# Altium project base-32-bit.PrjPcb
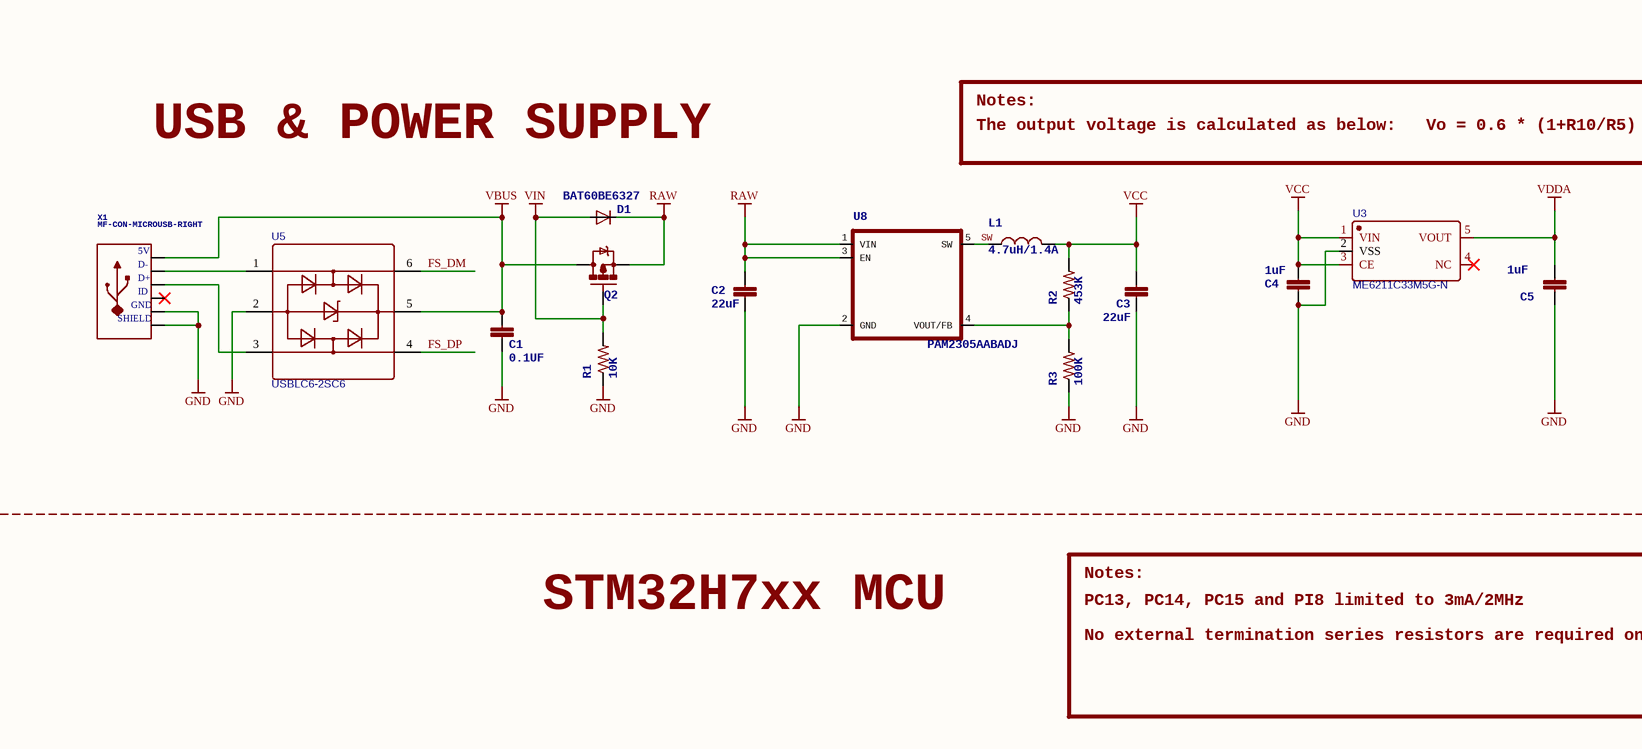
[diagram p0: base-32-bit.SchDoc, top left]
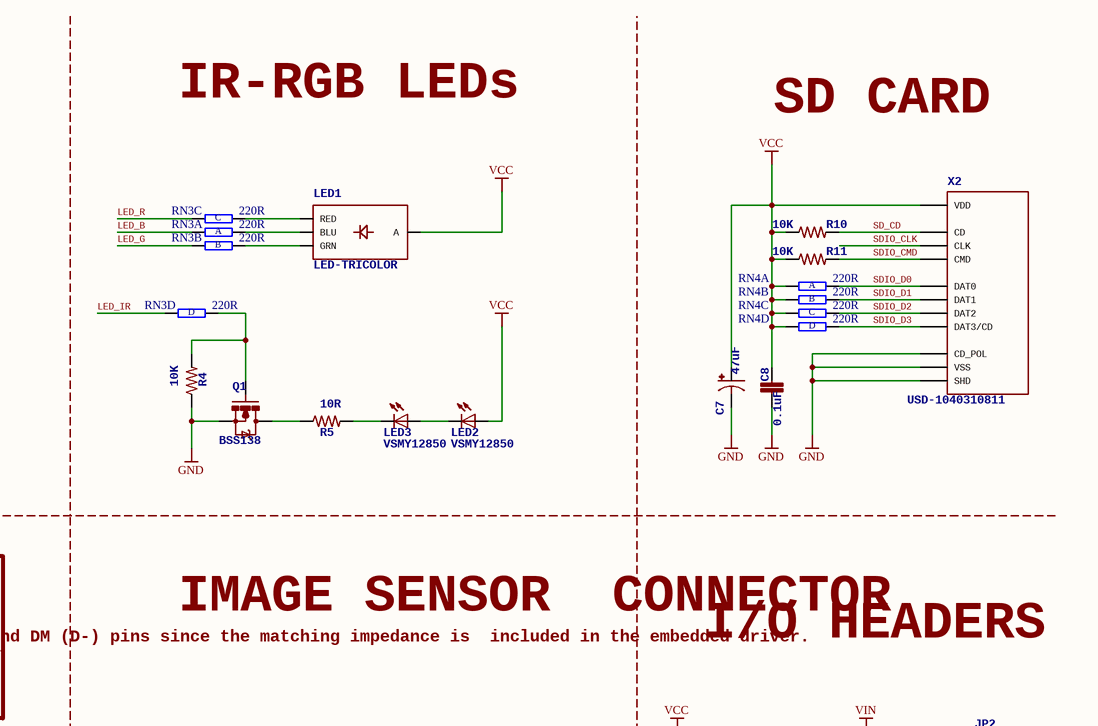
[diagram p1: base-32-bit.SchDoc, top right]
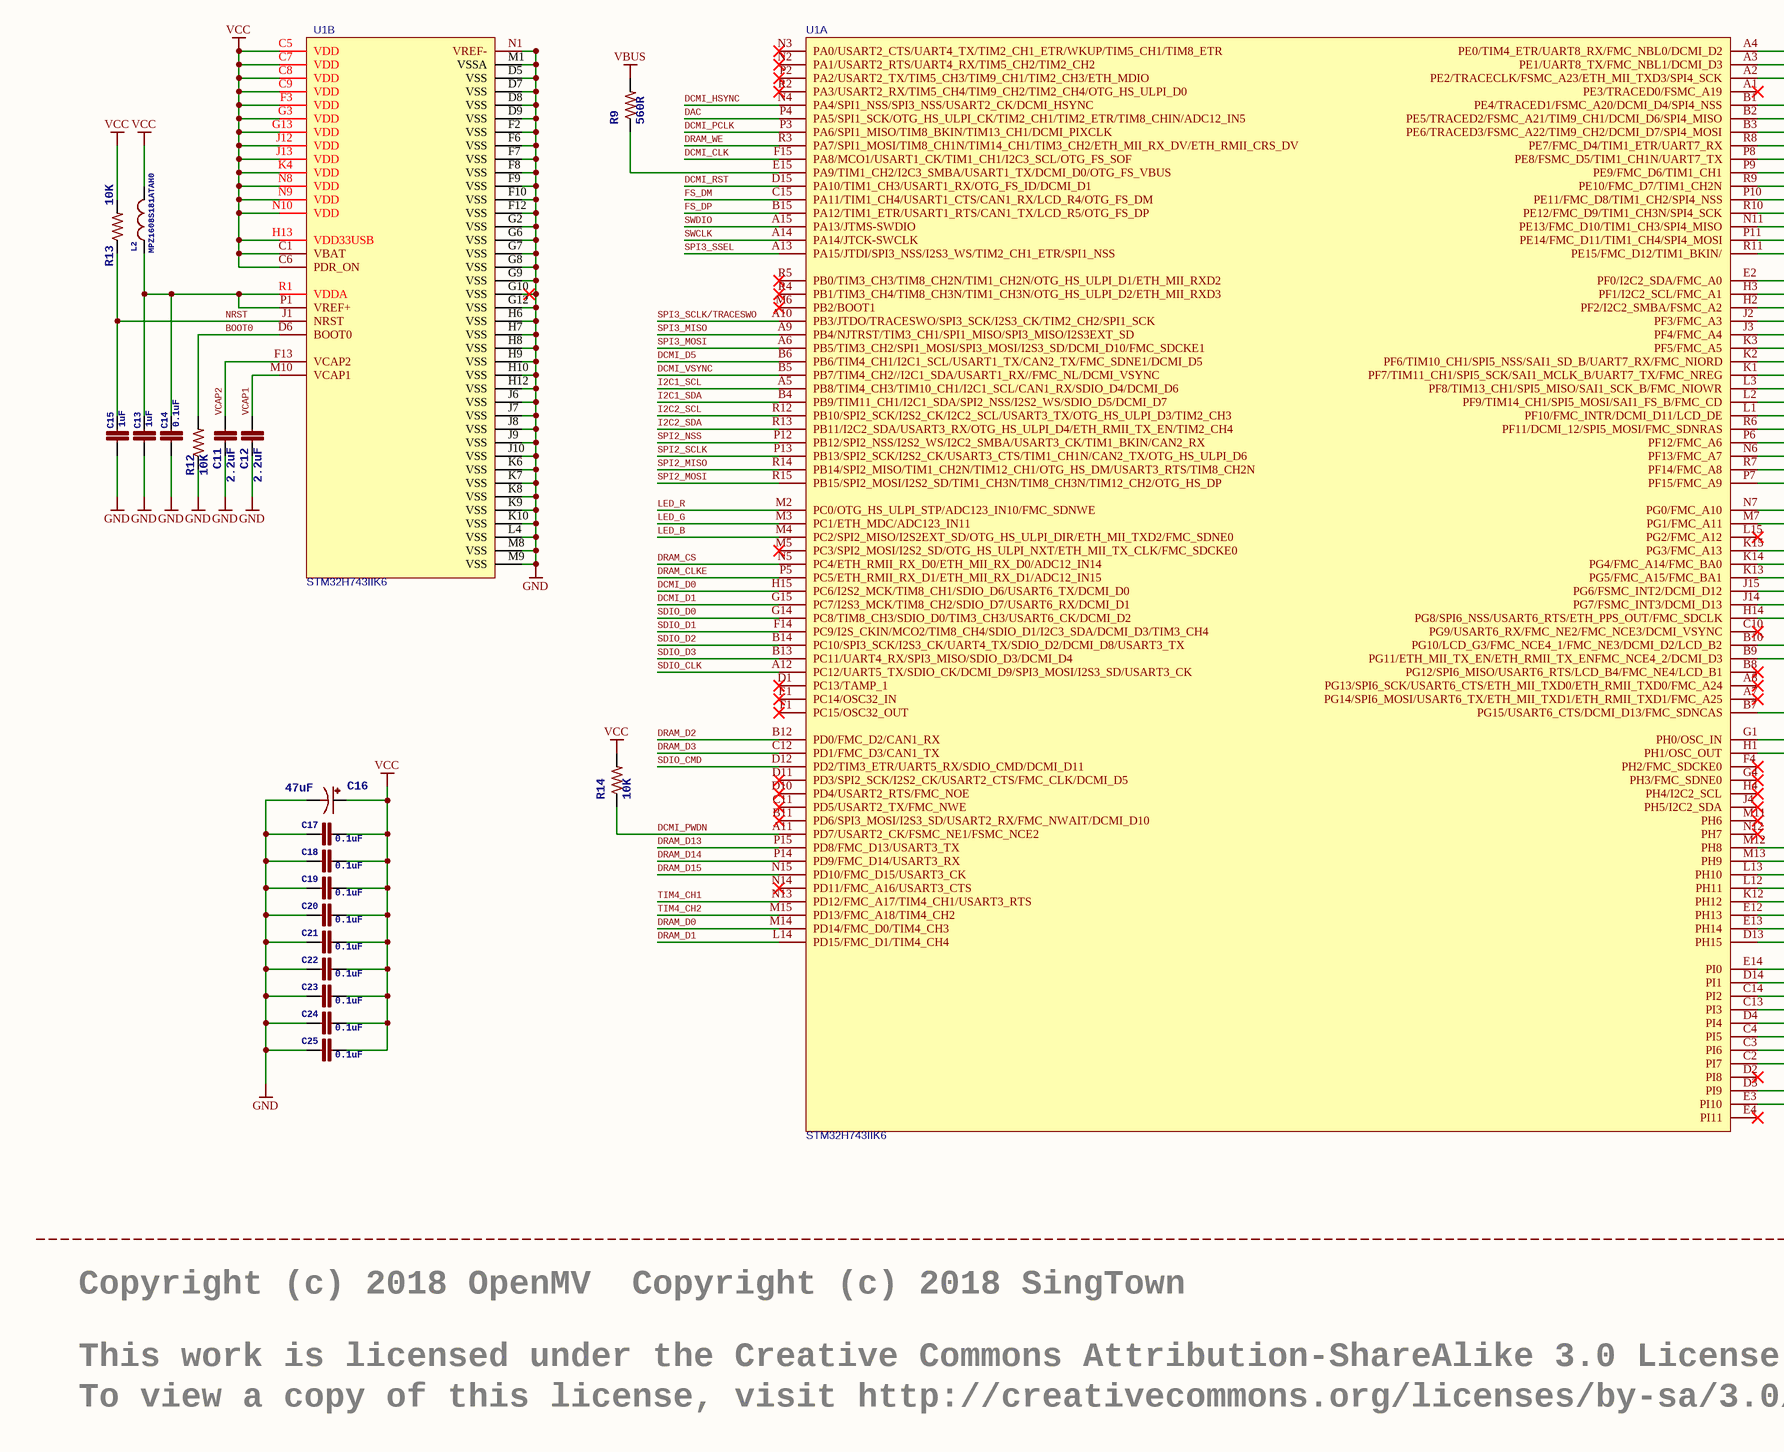
[diagram p2: base-32-bit.SchDoc, bottom left]
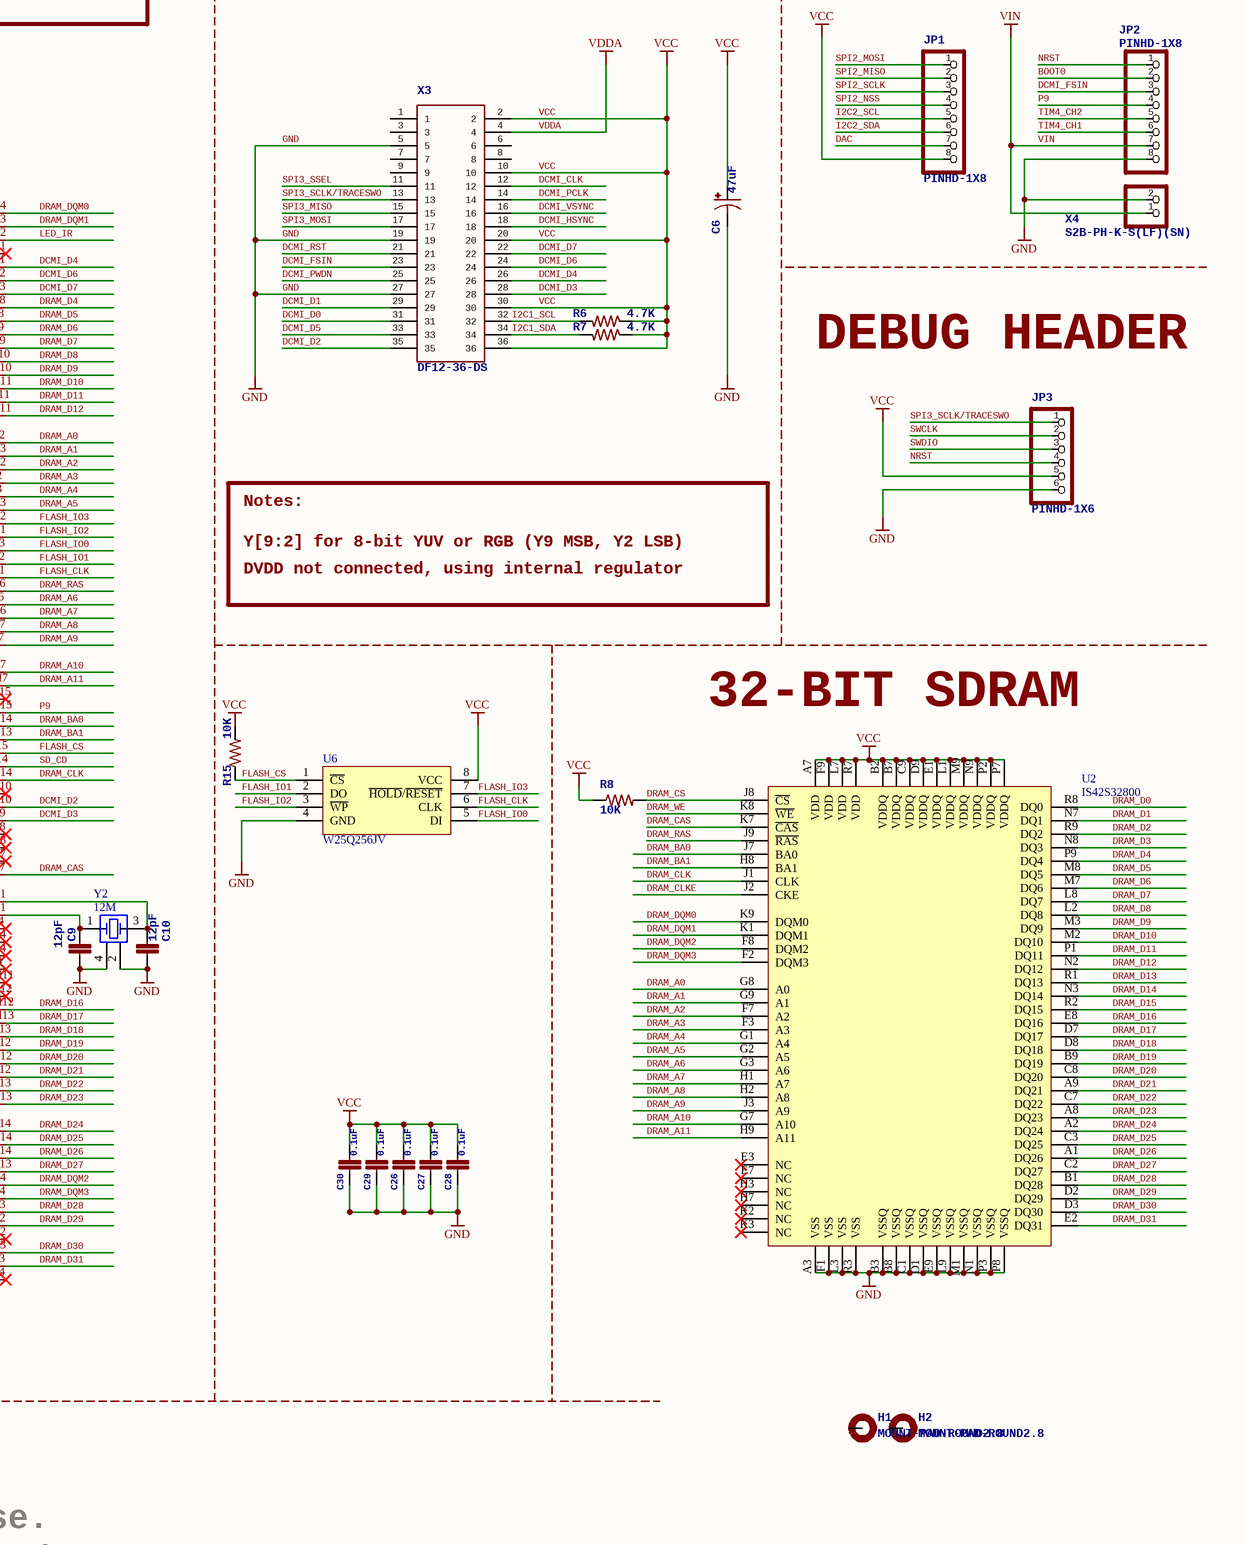
[diagram p3: base-32-bit.SchDoc, bottom right]
1 sheet, 71 parts. Net scope: global (net labels, ports and power ports of the same name join across sheets).
Board file: base-32-bit.PcbDoc

## Sheet base-32-bit.SchDoc
size 580 x 453 mm

### Parts
C1  0.1UF  [C0603]
C2  22uF  [0805]
C3  22uF  [0805]
C4  1uF  [0805]
C5  1uF  [0805]
C6  47uF  [EIA3216]
C7  47uF  [EIA3216]
C8  0.1uF  [0603-CAP]
C9  12pF  [0603-CAP]
C10  12pF  [0603-CAP]
C11  2.2uF  [C0402]
C12  2.2uF  [C0402]
C13  1uF  [C0402]
C14  0.1uF  [C0402]
C15  1uF  [C0402]
C16  47uF  [EIA3216]
C17  0.1uF  [C0402]
C18  0.1uF  [C0402]
C19  0.1uF  [C0402]
C20  0.1uF  [C0402]
C21  0.1uF  [C0402]
C22  0.1uF  [C0402]
C23  0.1uF  [C0402]
C24  0.1uF  [C0402]
C25  0.1uF  [C0402]
C26  0.1uF  [C0402]
C27  0.1uF  [C0402]
C28  0.1uF  [C0402]
C29  0.1uF  [C0402]
C30  0.1uF  [C0402]
D1  BAT60BE6327  [SOD-323]
H1  MOUNT-PAD-ROUND2.8  [2,8-PAD]
H2  MOUNT-PAD-ROUND2.8  [2,8-PAD]
JP1  PINHD-1X8  [1X08]
JP2  PINHD-1X8  [1X08]
JP3  PINHD-1X6  [1X06]
L1  4.7uH/1.4A  [1007]
L2  MPZ1608S181ATAH0  [0603]
LED1  LED-TRICOLOR  [LED-TRICOLOR-SMD]
LED2  VSMY12850  [LED-1206]
LED3  VSMY12850  [LED-1206]
Q1  BSS138  [SOT23-3]
Q2  Si2301BDS  [SOT23-3]  (value not drawn)
R1  10K  [R0603]
R2  453K  [R0603]
R3  100K  [R0603]
R4  10K  [R0603]
R5  10R  [R0603]
R6  4.7K  [R0603]
R7  4.7K  [R0603]
R8  10K  [R0402]
R9  560R  [R0603]
R10  10K  [R0603]
R11  10K  [R0603]
R12  10K  [R0603]
R13  10K  [R0402]
R14  10K  [R0603]
R15  10K  [R0603]
RN3  220R  [RCA-8P4R-0402]  (parts A,B,C,D of 4)
RN4  220R  [RCA-8P4R-0402]  (parts A,B,C,D of 4)
U1  STM32H743IIK6  [UFBGA-201_L10.0-W10.0-P0.65-TL_STM32H743IIK6]  (parts A,B of 2)
U2  IS42S32800  [BGA-90-8000X13000DE]
U3  ME6211C33M5G-N  [SOT-23-5]
U5  USBLC6-2SC6  [SOT-23-6]
U6  W25Q256JV  [WSON-8_L8.0-W6.10-P1.27-BL-EP]
U8  PAM2305AABADJ  [TSOT25]
X1  MF-CON-MICROUSB-RIGHT  [MICROUSB-RIGHT]
X2  USD-1040310811  [1040310811]
X3  DF12-36-DS  [DF12-36-DS]
X4  S2B-PH-K-S(LF)(SN)  [JST-PH-2-THM-RA]
Y2  12M  [OSC-SMD_4P-L2.5-W2.0-BL]

### Nets
GND: C1.1 C2.1 C3.1 C4.1 C5.1 C6.C(-) C7.C(-) C8.2 C9.1 C10.1 C11.2 C12.2 C13.2 C14.2 C15.2 C16.C(-) C17.2 C18.2 C19.2 C20.2 C21.2 C22.2 C23.2 C24.2 C25.2 C26.2 C27.2 C28.2 C29.2 C30.2 JP2.8 JP3.6 Q1.2(S) R1.1 R3.1 R4.1 R12.1 U1.D5(VSS) U1.D7(VSS) U1.D8(VSS) U1.D9(VSS) U1.F2(VSS) U1.F6(VSS) U1.F7(VSS) U1.F8(VSS) U1.F9(VSS) U1.F10(VSS) U1.F12(VSS) U1.G2(VSS) U1.G6(VSS) U1.G7(VSS) U1.G8(VSS) U1.G9(VSS) U1.G10(VSS) U1.G12(VSS) U1.H6(VSS) U1.H7(VSS) U1.H8(VSS) U1.H9(VSS) U1.H10(VSS) U1.H12(VSS) U1.J6(VSS) U1.J7(VSS) U1.J8(VSS) U1.J9(VSS) U1.J10(VSS) U1.K6(VSS) U1.K7(VSS) U1.K8(VSS) U1.K9(VSS) U1.K10(VSS) U1.L4(VSS) U1.M1(VSSA) U1.M8(VSS) U1.M9(VSS) U1.N1(VREF-) U2.A3(VSS) U2.B3(VSSQ) U2.B8(VSSQ) U2.C1(VSSQ) U2.D1(VSSQ) U2.E9(VSSQ) U2.F1(VSS) U2.L3(VSS) U2.L9(VSSQ) U2.M1(VSSQ) U2.N1(VSSQ) U2.P3(VSSQ) U2.P8(VSSQ) U2.R3(VSS) U3.2(VSS) U5.2 U6.4(GND) U8.2(GND) X1.5(GND) X1.S(SLD) X2.CD$2(CD_POL) X2.G(SHD) X2.P$6(VSS) X3.5 X3.19 X3.27 X4.2 Y2.2(OSC2) Y2.4(OSC4)
RAW: C2.2 D1.1(C) Q2.2(S) U8.1(VIN) U8.3(EN)
VBUS: C1.2 Q2.3(D) R9.2 U5.5 X1.1(5V)
VCC: C3.2 C4.2 C6.A(+) C7.A(+) C8.1 C16.A(+) C17.1 C18.1 C19.1 C20.1 C21.1 C22.1 C23.1 C24.1 C25.1 C26.1 C27.1 C28.1 C29.1 C30.1 JP1.8 JP3.5 L1.2 L2.2 LED1.A LED2.A R2.2 R6.1 R7.1 R8.1 R10.1 R11.1 R13.2 R14.2 R15.2 RN4.1 RN4.2 RN4.3 RN4.4 U1.C1(VBAT) U1.C5(VDD) U1.C6(PDR_ON) U1.C7(VDD) U1.C8(VDD) U1.C9(VDD) U1.F3(VDD) U1.G3(VDD) U1.G13(VDD) U1.H13(VDD33USB) U1.J12(VDD) U1.J13(VDD) U1.K4(VDD) U1.N8(VDD) U1.N9(VDD) U1.N10(VDD) U2.A7(VDD) U2.B2(VDDQ) U2.B7(VDDQ) U2.C9(VDDQ) U2.D9(VDDQ) U2.E1(VDDQ) U2.F9(VDD) U2.L1(VDDQ) U2.L7(VDD) U2.M9(VDDQ) U2.N9(VDDQ) U2.P2(VDDQ) U2.P7(VDDQ) U2.R7(VDD) U3.1(VIN) U3.3(CE) U6.8(VCC) X2.P$4(VDD) X3.2 X3.10 X3.20 X3.30 X3.36
VDDA: C5.2 U3.5(VOUT) X3.4
VIN: D1.2(A) JP2.7 Q2.1(G) R1.2 X4.1
BOOT0: JP2.2 R12.2 U1.D6(BOOT0)
DAC: JP1.7 U1.P4(PA5/SPI1_SCK/OTG_HS_ULPI_CK/TIM2_CH1/TIM2_ETR/TIM8_CHIN/ADC12_IN5)
DCMI_CLK: U1.F15(PA8/MCO1/USART1_CK/TIM1_CH1/I2C3_SCL/OTG_FS_SOF) X3.12
DCMI_D0: U1.H15(PC6/I2S2_MCK/TIM8_CH1/SDIO_D6/USART6_TX/DCMI_D0) X3.31
DCMI_D1: U1.G15(PC7/I2S3_MCK/TIM8_CH2/SDIO_D7/USART6_RX/DCMI_D1) X3.29
DCMI_D2: U1.B10(PG10/LCD_G3/FMC_NCE4_1/FMC_NE3/DCMI_D2/LCD_B2) X3.35
DCMI_D3: U1.B9(PG11/ETH_MII_TX_EN/ETH_RMII_TX_ENFMC_NCE4_2/DCMI_D3) X3.28
DCMI_D4: U1.B1(PE4/TRACED1/FSMC_A20/DCMI_D4/SPI4_NSS) X3.26
DCMI_D5: U1.B6(PB6/TIM4_CH1/I2C1_SCL/USART1_TX/CAN2_TX/FMC_SDNE1/DCMI_D5) X3.33
DCMI_D6: U1.B2(PE5/TRACED2/FSMC_A21/TIM9_CH1/DCMI_D6/SPI4_MISO) X3.24
DCMI_D7: U1.B3(PE6/TRACED3/FSMC_A22/TIM9_CH2/DCMI_D7/SPI4_MOSI) X3.22
DCMI_FSIN: JP2.3 X3.23
DCMI_HSYNC: U1.N4(PA4/SPI1_NSS/SPI3_NSS/USART2_CK/DCMI_HSYNC) X3.18
DCMI_PCLK: U1.P3(PA6/SPI1_MISO/TIM8_BKIN/TIM13_CH1/DCMI_PIXCLK) X3.14
DCMI_PWDN: R14.1 U1.A11(PD7/USART2_CK/FSMC_NE1/FSMC_NCE2) X3.25
DCMI_RST: U1.D15(PA10/TIM1_CH3/USART1_RX/OTG_FS_ID/DCMI_D1) X3.21
DCMI_VSYNC: U1.B5(PB7/TIM4_CH2//I2C1_SDA/USART1_RX//FMC_NL/DCMI_VSYNC) X3.16
DRAM_A0: U1.E2(PF0/I2C2_SDA/FMC_A0) U2.G8(A0)
DRAM_A1: U1.H3(PF1/I2C2_SCL/FMC_A1) U2.G9(A1)
DRAM_A2: U1.H2(PF2/I2C2_SMBA/FSMC_A2) U2.F7(A2)
DRAM_A3: U1.J2(PF3/FMC_A3) U2.F3(A3)
DRAM_A4: U1.J3(PF4/FMC_A4) U2.G1(A4)
DRAM_A5: U1.K3(PF5/FMC_A5) U2.G2(A5)
DRAM_A6: U1.P6(PF12/FMC_A6) U2.G3(A6)
DRAM_A7: U1.N6(PF13/FMC_A7) U2.H1(A7)
DRAM_A8: U1.R7(PF14/FMC_A8) U2.H2(A8)
DRAM_A9: U1.P7(PF15/FMC_A9) U2.J3(A9)
DRAM_A10: U1.N7(PG0/FMC_A10) U2.G7(A10)
DRAM_A11: U1.M7(PG1/FMC_A11) U2.H9(A11)
DRAM_BA0: U1.K14(PG4/FMC_A14/FMC_BA0) U2.J7(BA0)
DRAM_BA1: U1.K13(PG5/FMC_A15/FMC_BA1) U2.H8(BA1)
DRAM_CAS: U1.B7(PG15/USART6_CTS/DCMI_D13/FMC_SDNCAS) U2.K7(~{CAS})
DRAM_CLK: U1.H14(PG8/SPI6_NSS/USART6_RTS/ETH_PPS_OUT/FMC_SDCLK) U2.J1(CLK)
DRAM_CLKE: U1.P5(PC5/ETH_RMII_RX_D1/ETH_MII_RX_D1/ADC12_IN15) U2.J2(CKE)
DRAM_CS: R8.2 U1.N5(PC4/ETH_RMII_RX_D0/ETH_MII_RX_D0/ADC12_IN14) U2.J8(~{CS})
DRAM_D0: U1.M14(PD14/FMC_D0/TIM4_CH3) U2.R8(DQ0)
DRAM_D1: U1.L14(PD15/FMC_D1/TIM4_CH4) U2.N7(DQ1)
DRAM_D2: U1.B12(PD0/FMC_D2/CAN1_RX) U2.R9(DQ2)
DRAM_D3: U1.C12(PD1/FMC_D3/CAN1_TX) U2.N8(DQ3)
DRAM_D4: U1.R8(PE7/FMC_D4/TIM1_ETR/UART7_RX) U2.P9(DQ4)
DRAM_D5: U1.P8(PE8/FSMC_D5/TIM1_CH1N/UART7_TX) U2.M8(DQ5)
DRAM_D6: U1.P9(PE9/FMC_D6/TIM1_CH1) U2.M7(DQ6)
DRAM_D7: U1.R9(PE10/FMC_D7/TIM1_CH2N) U2.L8(DQ7)
DRAM_D8: U1.P10(PE11/FMC_D8/TIM1_CH2/SPI4_NSS) U2.L2(DQ8)
DRAM_D9: U1.R10(PE12/FMC_D9/TIM1_CH3N/SPI4_SCK) U2.M3(DQ9)
DRAM_D10: U1.N11(PE13/FMC_D10/TIM1_CH3/SPI4_MISO) U2.M2(DQ10)
DRAM_D11: U1.P11(PE14/FMC_D11/TIM1_CH4/SPI4_MOSI) U2.P1(DQ11)
DRAM_D12: U1.R11(PE15/FMC_D12/TIM1_BKIN/) U2.N2(DQ12)
DRAM_D13: U1.P15(PD8/FMC_D13/USART3_TX) U2.R1(DQ13)
DRAM_D14: U1.P14(PD9/FMC_D14/USART3_RX) U2.N3(DQ14)
DRAM_D15: U1.N15(PD10/FMC_D15/USART3_CK) U2.R2(DQ15)
DRAM_D16: U1.M12(PH8) U2.E8(DQ16)
DRAM_D17: U1.M13(PH9) U2.D7(DQ17)
DRAM_D18: U1.L13(PH10) U2.D8(DQ18)
DRAM_D19: U1.L12(PH11) U2.B9(DQ19)
DRAM_D20: U1.K12(PH12) U2.C8(DQ20)
DRAM_D21: U1.E12(PH13) U2.A9(DQ21)
DRAM_D22: U1.E13(PH14) U2.C7(DQ22)
DRAM_D23: U1.D13(PH15) U2.A8(DQ23)
DRAM_D24: U1.E14(PI0) U2.A2(DQ24)
DRAM_D25: U1.D14(PI1) U2.C3(DQ25)
DRAM_D26: U1.C14(PI2) U2.A1(DQ26)
DRAM_D27: U1.C13(PI3) U2.C2(DQ27)
DRAM_D28: U1.C3(PI6) U2.B1(DQ28)
DRAM_D29: U1.C2(PI7) U2.D2(DQ29)
DRAM_D30: U1.D3(PI9) U2.D3(DQ30)
DRAM_D31: U1.E3(PI10) U2.E2(DQ31)
DRAM_DQM0: U1.A4(PE0/TIM4_ETR/UART8_RX/FMC_NBL0/DCMI_D2) U2.K9(DQM0)
DRAM_DQM1: U1.A3(PE1/UART8_TX/FMC_NBL1/DCMI_D3) U2.K1(DQM1)
DRAM_DQM2: U1.D4(PI4) U2.F8(DQM2)
DRAM_DQM3: U1.C4(PI5) U2.F2(DQM3)
DRAM_RAS: U1.R6(PF11/DCMI_12/SPI5_MOSI/FMC_SDNRAS) U2.J9(~{RAS})
DRAM_WE: U1.R3(PA7/SPI1_MOSI/TIM8_CH1N/TIM14_CH1/TIM3_CH2/ETH_MII_RX_DV/ETH_RMII_CRS_DV) U2.K8(~{WE})
FLASH_CLK: U1.L1(PF10/FMC_INTR/DCMI_D11/LCD_DE) U6.6(CLK)
FLASH_CS: R15.1 U1.J15(PG6/FSMC_INT2/DCMI_D12) U6.1(~{CS})
FLASH_IO0: U1.L3(PF8/TIM13_CH1/SPI5_MISO/SAI1_SCK_B/FMC_NIOWR) U6.5(DI)
FLASH_IO1: U1.L2(PF9/TIM14_CH1/SPI5_MOSI/SAI1_FS_B/FMC_CD) U6.2(DO)
FLASH_IO2: U1.K1(PF7/TIM11_CH1/SPI5_SCK/SAI1_MCLK_B/UART7_TX/FMC_NREG) U6.3(~{WP})
FLASH_IO3: U1.K2(PF6/TIM10_CH1/SPI5_NSS/SAI1_SD_B/UART7_RX/FMC_NIORD) U6.7(~{HOLD}/~{RESET})
FS_DM: U1.C15(PA11/TIM1_CH4/USART1_CTS/CAN1_RX/LCD_R4/OTG_FS_DM) U5.6
FS_DP: U1.B15(PA12/TIM1_ETR/USART1_RTS/CAN1_TX/LCD_R5/OTG_FS_DP) U5.4
I2C1_SCL: R6.2 U1.A5(PB8/TIM4_CH3/TIM10_CH1/I2C1_SCL/CAN1_RX/SDIO_D4/DCMI_D6) X3.32
I2C1_SDA: R7.2 U1.B4(PB9/TIM11_CH1/I2C1_SDA/SPI2_NSS/I2S2_WS/SDIO_D5/DCMI_D7) X3.34
I2C2_SCL: JP1.5 U1.R12(PB10/SPI2_SCK/I2S2_CK/I2C2_SCL/USART3_TX/OTG_HS_ULPI_D3/TIM2_CH3)
I2C2_SDA: JP1.6 U1.R13(PB11/I2C2_SDA/USART3_RX/OTG_HS_ULPI_D4/ETH_RMII_TX_EN/TIM2_CH4)
LED_B: RN3.1 U1.M4(PC2/SPI2_MISO/I2S2EXT_SD/OTG_HS_ULPI_DIR/ETH_MII_TXD2/FMC_SDNE0)
LED_G: RN3.2 U1.M3(PC1/ETH_MDC/ADC123_IN11)
LED_IR: RN3.4 U1.A2(PE2/TRACECLK/FSMC_A23/ETH_MII_TXD3/SPI4_SCK)
LED_R: RN3.3 U1.M2(PC0/OTG_HS_ULPI_STP/ADC123_IN10/FMC_SDNWE)
NRST: C15.1 JP2.1 JP3.4 R13.1 U1.J1(NRST)
P9: JP2.4 U1.K15(PG3/FMC_A13)
SD_CD: R10.2 U1.J14(PG7/FSMC_INT3/DCMI_D13) X2.CD$1(CD)
SDIO_CLK: U1.A12(PC12/UART5_TX/SDIO_CK/DCMI_D9/SPI3_MOSI/I2S3_SD/USART3_CK) X2.P$5(CLK)
SDIO_CMD: R11.2 U1.D12(PD2/TIM3_ETR/UART5_RX/SDIO_CMD/DCMI_D11) X2.P$3(CMD)
SDIO_D0: RN4.8 U1.G14(PC8/TIM8_CH3/SDIO_D0/TIM3_CH3/USART6_CK/DCMI_D2) X2.P$7(DAT0)
SDIO_D1: RN4.7 U1.F14(PC9/I2S_CKIN/MCO2/TIM8_CH4/SDIO_D1/I2C3_SDA/DCMI_D3/TIM3_CH4) X2.P$8(DAT1)
SDIO_D2: RN4.6 U1.B14(PC10/SPI3_SCK/I2S3_CK/UART4_TX/SDIO_D2/DCMI_D8/USART3_TX) X2.P$1(DAT2)
SDIO_D3: RN4.5 U1.B13(PC11/UART4_RX/SPI3_MISO/SDIO_D3/DCMI_D4) X2.P$2(DAT3/CD)
SPI2_MISO: JP1.2 U1.R14(PB14/SPI2_MISO/TIM1_CH2N/TIM12_CH1/OTG_HS_DM/USART3_RTS/TIM8_CH2N)
SPI2_MOSI: JP1.1 U1.R15(PB15/SPI2_MOSI/I2S2_SD/TIM1_CH3N/TIM8_CH3N/TIM12_CH2/OTG_HS_DP)
SPI2_NSS: JP1.4 U1.P12(PB12/SPI2_NSS/I2S2_WS/I2C2_SMBA/USART3_CK/TIM1_BKIN/CAN2_RX)
SPI2_SCLK: JP1.3 U1.P13(PB13/SPI2_SCK/I2S2_CK/USART3_CTS/TIM1_CH1N/CAN2_TX/OTG_HS_ULPI_D6)
SPI3_MISO: U1.A9(PB4/NJTRST/TIM3_CH1/SPI1_MISO/SPI3_MISO/I2S3EXT_SD) X3.15
SPI3_MOSI: U1.A6(PB5/TIM3_CH2/SPI1_MOSI/SPI3_MOSI/I2S3_SD/DCMI_D10/FMC_SDCKE1) X3.17
SPI3_SCLK/TRACESWO: JP3.1 U1.A10(PB3/JTDO/TRACESWO/SPI3_SCK/I2S3_CK/TIM2_CH2/SPI1_SCK) X3.13
SPI3_SSEL: U1.A13(PA15/JTDI/SPI3_NSS/I2S3_WS/TIM2_CH1_ETR/SPI1_NSS) X3.11
SW: L1.1 U8.5(SW)
SWCLK: JP3.2 U1.A14(PA14/JTCK-SWCLK)
SWDIO: JP3.3 U1.A15(PA13/JTMS-SWDIO)
TIM4_CH1: JP2.6 U1.N13(PD12/FMC_A17/TIM4_CH1/USART3_RTS)
TIM4_CH2: JP2.5 U1.M15(PD13/FMC_A18/TIM4_CH2)
VCAP1: C12.1 U1.M10(VCAP1)
VCAP2: C11.1 U1.F13(VCAP2)
NetC9_2: C9.2 U1.H1(PH1/OSC_OUT) Y2.1(OSC1)
NetC10_2: C10.2 U1.G1(PH0/OSC_IN) Y2.3(OSC3)
NetC13_1: C13.1 C14.1 L2.1 U1.P1(VREF+) U1.R1(VDDA)
NetLED1_B: LED1.B(BLU) RN3.8
NetLED1_G: LED1.G(GRN) RN3.7
NetLED1_R: LED1.R(RED) RN3.6
NetLED2_C: LED2.C LED3.A
NetLED3_C: LED3.C R5.2
NetQ1_1: Q1.1(G) R4.2 RN3.5
NetQ1_3: Q1.3(D) R5.1
NetR2_1: R2.1 R3.2 U8.4(VOUT/FB)
NetR9_1: R9.1 U1.E15(PA9/TIM1_CH2/I2C3_SMBA/USART1_TX/DCMI_D0/OTG_FS_VBUS)
NetU5_1: U5.1 X1.2(D-)
NetU5_3: U5.3 X1.3(D+)

Not connected (* = marked no-connect by the designer): H1 B2,8(MOUNT); H2 B2,8(MOUNT); U1 A1(PE3/TRACED0/FSMC_A19)* A7(PG14/SPI6_MOSI/USART6_TX/ETH_MII_TXD1/ETH_RMII_TXD1/FMC_A25)* A8(PG13/SPI6_SCK/USART6_CTS/ETH_MII_TXD0/ETH_RMII_TXD0/FMC_A24)* B8(PG12/SPI6_MISO/USART6_RTS/LCD_B4/FMC_NE4/LCD_B1)* B11(PD6/SPI3_MOSI/I2S3_SD/USART2_RX/FMC_NWAIT/DCMI_D10)* C10(PG9/USART6_RX/FMC_NE2/FMC_NCE3/DCMI_VSYNC)* C11(PD5/USART2_TX/FMC_NWE)* D1(PC13/TAMP_1)* D2(PI8)* D10(PD4/USART2_RTS/FMC_NOE)* D11(PD3/SPI2_SCK/I2S2_CK/USART2_CTS/FMC_CLK/DCMI_D5)* E1(PC14/OSC32_IN)* E4(PI11)* F1(PC15/OSC32_OUT)* F4(PH2/FMC_SDCKE0)* G4(PH3/FMC_SDNE0)* H4(PH4/I2C2_SCL)* J4(PH5/I2C2_SDA)* L15(PG2/FMC_A12)* M5(PC3/SPI2_MOSI/I2S2_SD/OTG_HS_ULPI_NXT/ETH_MII_TX_CLK/FMC_SDCKE0)* M6(PB2/BOOT1)* M11(PH6)* N2(PA1/USART2_RTS/UART4_RX/TIM5_CH2/TIM2_CH2)* N3(PA0/USART2_CTS/UART4_TX/TIM2_CH1_ETR/WKUP/TIM5_CH1/TIM8_ETR)* N12(PH7)* N14(PD11/FMC_A16/USART3_CTS)* P2(PA2/USART2_TX/TIM5_CH3/TIM9_CH1/TIM2_CH3/ETH_MDIO)* R2(PA3/USART2_RX/TIM5_CH4/TIM9_CH2/TIM2_CH4/OTG_HS_ULPI_D0)* R4(PB1/TIM3_CH4/TIM8_CH3N/TIM1_CH3N/OTG_HS_ULPI_D2/ETH_MII_RXD3)* R5(PB0/TIM3_CH3/TIM8_CH2N/TIM1_CH2N/OTG_HS_ULPI_D1/ETH_MII_RXD2)*; U2 E3(NC)* E7(NC)* H3(NC)* H7(NC)* K2(NC)* K3(NC)*; U3 4(NC)*; X1 4(ID)*; X3 1 3 6 7 8 9

### Notes on the sheet
- The output voltage is calculated as below:
  Vo = 0.6 * (1+R10/R5)
- Notes:
- IR-RGB LEDs
- SD CARD
- USB & POWER SUPPLY
- (near X1) 5V
- (near X1) D-
- (near X1) SHIELD
- (near X1) GND
- (near X1) D+
- (near X1) ID
- PC13, PC14, PC15 and PI8 limited to 3mA/2MHz
- STM32H7xx MCU
- No external termination series resistors are required on
  DP (D+) and DM (D-) pins since the matching impedance is
  included in the embedded driver.
- IMAGE SENSOR
  CONNECTOR
- I/O HEADERS
- DEBUG HEADER
- Y[9:2] for 8-bit YUV or RGB (Y9 MSB, Y2 LSB)
- DVDD not connected, using internal regulator
- 32-BIT SDRAM
- Copyright (c) 2018 OpenMV
  Copyright (c) 2018 SingTown
- This work is licensed under the Creative Commons Attribution-ShareAlike 3.0 License.
- To view a copy of this license, visit http://creativecommons.org/licenses/by-sa/3.0/
- 1
- 2
- 3
- 4
- 5
- 6
- 7
- 8
- 9
- 10
- 11
- A
- B
- C
- D
- E
- F
- G
- H
- I
- (in symbol 排阻_4P, part A) A
- (in symbol 排阻_4P, part B) B
- (in symbol 排阻_4P, part C) C
- (in symbol 排阻_4P, part D) D

### Library data of the parts
C1-C5 = CAP0805: CapacitorStandard 0603 ceramic capacitor, and 0.1" leaded capacitor.
C6 C7 C16 = CAP_POL1206: Capacitor PolarizedThese are standard SMD and PTH capacitors. Normally 10uF, 47uF, and 100uF in electrolytic and tantalum varieties. Always verify the external diameter of the through hole cap, it varies with capacity, voltage, and manufacturer. The EIA devices should be standard.
C8-C12 = CAP0603-CAP: CapacitorStandard 0603 ceramic capacitor, and 0.1" leaded capacitor.
C13-C15 C17-C30 = CAP0402-CAP: CapacitorStandard 0603 ceramic capacitor, and 0.1" leaded capacitor.
D1 = DIODESOD: DiodeThese are standard reverse protection diodes and small signal diodes. SMA package can handle up to about 1A. SOD-323 can handle about 200mA. What the SOD-323 package when ordering, there are some mfgs out there that are 5-pin packages.
H1 H2 = MOUNT-PAD-ROUND2.8: MOUNTING PAD, round
JP1 JP2 = PINHD-1X8: PIN HEADER
JP3 = PINHD-1X6: PIN HEADER
L1 = INDUCTOR1007: InductorsBasic Inductor/Choke - 0603 and 1206. Footprints are not proven and vary greatly between part numbers.
L2 = INDUCTOR0603: InductorsBasic Inductor/Choke - 0603 and 1206. Footprints are not proven and vary greatly between part numbers.
LED1 = LED-TRICOLOR: Tri-Color LED SMDProven layout and schematic for triple color LED in SMD package - common anode. Spark Fun Electronics SKU : COM-07844
LED2 LED3 = LED1206: LEDsStandard schematic elements and footprints for 5mm, 3mm, 1206, and 0603 sized LEDs. 5mm - Spark Fun Electronics SKU : COM-00529 (and others)
Q1 = MOSFET-NCHANNELSMD
Q2 = MOSFET-PCHANNELSMD
R1-R7 R9-R14 = RESISTOR0603-RES: ResistorBasic schematic elements and footprints for 0603, 1206, and PTH resistors.
R8 R15 = RESISTOR0402-RES: ResistorBasic schematic elements and footprints for 0603, 1206, and PTH resistors.
RN3 RN4 = 排阻_4P
U1 = STM32H743IIK6: BOM_Manufacturer: STMicroelectronics; subpart_no: 2; Contributor: LCSC; BOM_Supplier: LCSC; BOM_Supplier Part: C129442; BOM_Manufacturer Part: STM32H743IIK6; spicePre: U; spiceSymbolName: STM32H743IIK6
U3 = ME6211C33M5G-N: BOM_Manufacturer: MICRONE; SMT Type: Extend; BOM_Supplier: LCSC; BOM_Manufacturer Part: ME6211C33M5G-N; image: //image.lceda.cn/szlcsc/C82942.jpg; BOM_Supplier Part: C82942; BOM_LCSC Assembly: Yes; spicePre: L; spiceSymbolName: ME6211C33M5G-N
U5 = USBLC6-2SC6: BOM_Manufacturer: STMicroelectronics; SMT Type: Extend; BOM_Supplier: LCSC; BOM_Manufacturer Part: USBLC6-2SC6; image: //image.lceda.cn/szlcsc/C7519.jpg; BOM_Supplier Part: C7519; BOM_LCSC Assembly: Yes; spicePre: D; spiceSymbolName: USBLC6-2SC6
U6 = W25Q128JVSQ
U8 = PAM2305AAB330
X1 = USB_MICRO_RIGHT: Library:  MF_Connectors Description: 5 Pin USB Connectors. SLD is the shield connection. Usually tied to ground through a small ferrite bead.
X4 = JST_2PIN-THM-RA: JST 2-Pin Connectors of various flavors SMT-RA (S2B-PH-SM4) 4UConnector #17311  SMT  (B2B-PH-SM4)  THM-RA (S2B-PH)  THM  (B2B-PH)
Y2 = XTAL-NV-4